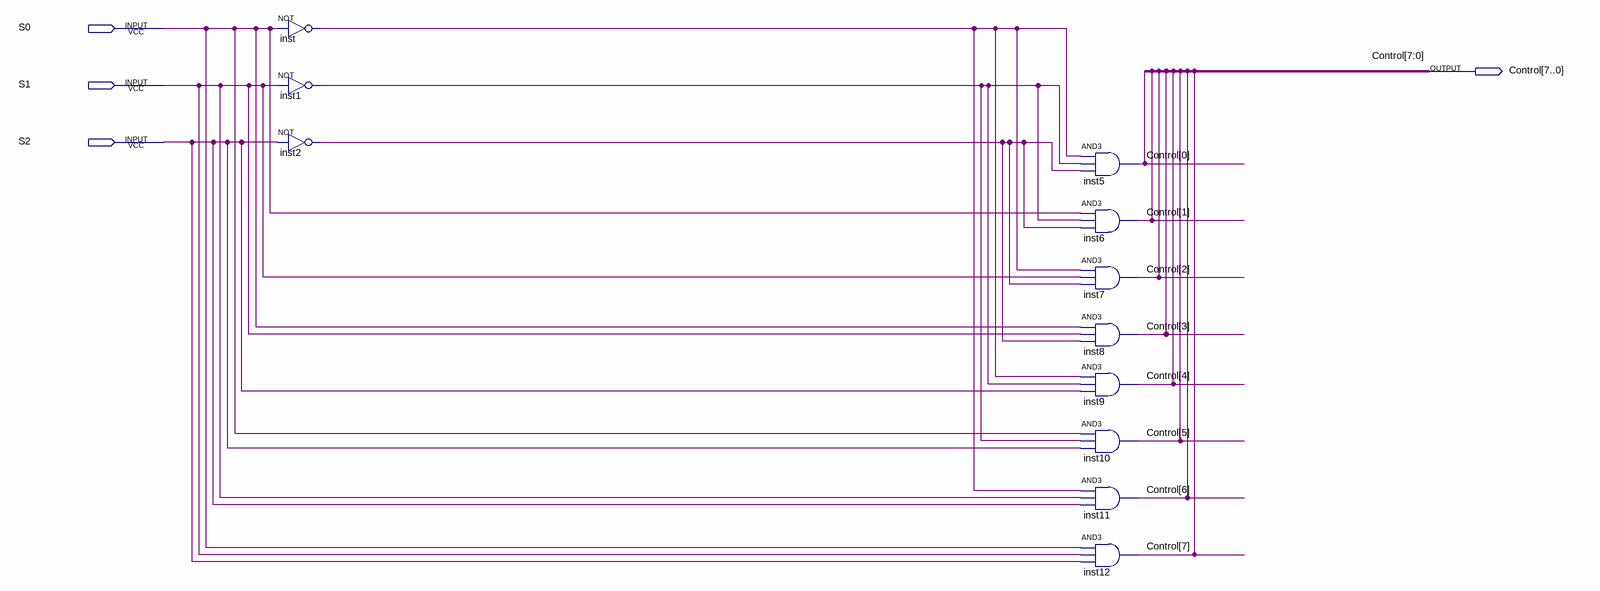
[diagram p0: schematic sheet]
// Quartus schematic demux.bdf as structural Verilog: 11 symbols, 4 pins
module demux (
  input  S0,
  input  S1,
  input  S2,
  output [7:0] Control
);

  wire inst1_out, inst2_out, inst_out;

  not inst (inst_out, S0);
  not inst1 (inst1_out, S1);
  not inst2 (inst2_out, S2);
  and inst5 (Control[0], inst_out, inst1_out, inst2_out);
  and inst6 (Control[1], S0, inst1_out, inst2_out);
  and inst7 (Control[2], inst_out, S1, inst2_out);
  and inst8 (Control[3], S0, S1, inst2_out);
  and inst9 (Control[4], inst_out, inst1_out, S2);
  and inst10 (Control[5], S0, inst1_out, S2);
  and inst11 (Control[6], inst_out, S1, S2);
  and inst12 (Control[7], S0, S1, S2);
endmodule
